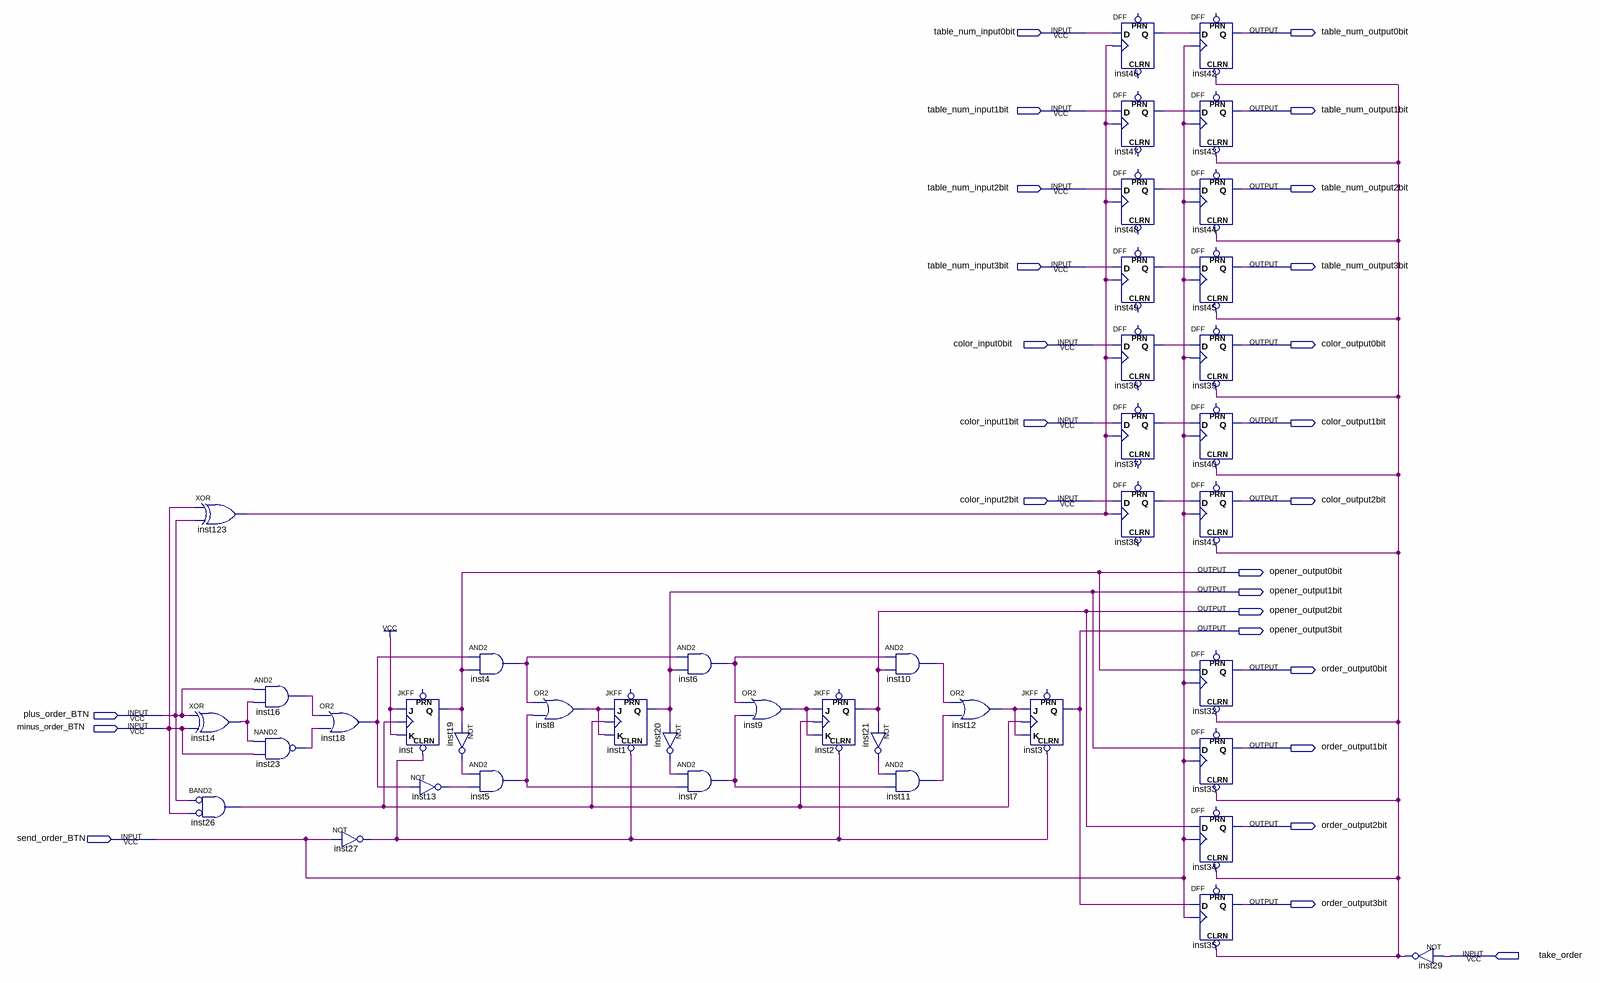
[diagram p0: schematic sheet]
// Quartus schematic opener_remote_control.bdf as structural Verilog: 43 symbols, 26 pins
module opener_remote_control (
  input  table_num_input0bit,
  input  table_num_input1bit,
  input  table_num_input2bit,
  input  table_num_input3bit,
  input  color_input0bit,
  input  color_input1bit,
  input  color_input2bit,
  input  plus_order_BTN,
  input  minus_order_BTN,
  input  send_order_BTN,
  input  take_order,
  output table_num_output0bit,
  output table_num_output1bit,
  output table_num_output2bit,
  output table_num_output3bit,
  output color_output0bit,
  output color_output1bit,
  output color_output2bit,
  output opener_output0bit,
  output opener_output1bit,
  output opener_output2bit,
  output opener_output3bit,
  output order_output0bit,
  output order_output1bit,
  output order_output2bit,
  output order_output3bit
);

  wire inst4_out, inst5_out, inst6_out, inst7_out, inst8_out, inst9_out, inst10_out, inst11_out, inst12_out,
       inst13_out, inst14_out, inst16_out, inst18_out, inst19_out, inst20_out, inst21_out, inst23_out,
       inst26_out, inst27_out, inst29_out, inst36_q, inst37_q, inst38_q, inst46_q, inst47_q, inst48_q,
       inst49_q, inst123_out;

  xor inst123 (inst123_out, minus_order_BTN, plus_order_BTN);
  xor inst14 (inst14_out, plus_order_BTN, minus_order_BTN);
  and inst26 (inst26_out, ~plus_order_BTN, ~minus_order_BTN);  // BAND2
  and inst16 (inst16_out, plus_order_BTN, inst14_out);
  nand inst23 (inst23_out, inst14_out, minus_order_BTN);
  or inst18 (inst18_out, inst16_out, inst23_out);
  not inst27 (inst27_out, send_order_BTN);
  JKFF inst (.CLRN(inst27_out), .K(1'b1), .J(1'b1), .CLK(inst26_out), .Q(opener_output0bit));  // open: PRN
  not inst13 (inst13_out, inst18_out);
  not inst19 (inst19_out, opener_output0bit);
  and inst4 (inst4_out, inst18_out, opener_output0bit);
  and inst5 (inst5_out, inst19_out, inst13_out);
  or inst8 (inst8_out, inst4_out, inst5_out);
  JKFF inst1 (.CLRN(inst27_out), .K(inst8_out), .J(inst8_out), .CLK(inst26_out), .Q(opener_output1bit));  // open: PRN
  not inst20 (inst20_out, opener_output1bit);
  and inst6 (inst6_out, inst4_out, opener_output1bit);
  and inst7 (inst7_out, inst20_out, inst5_out);
  or inst9 (inst9_out, inst6_out, inst7_out);
  JKFF inst2 (.CLRN(inst27_out), .K(inst9_out), .J(inst9_out), .CLK(inst26_out), .Q(opener_output2bit));  // open: PRN
  not inst21 (inst21_out, opener_output2bit);
  and inst10 (inst10_out, inst6_out, opener_output2bit);
  and inst11 (inst11_out, inst21_out, inst7_out);
  or inst12 (inst12_out, inst10_out, inst11_out);
  JKFF inst3 (.CLRN(inst27_out), .K(inst12_out), .J(inst12_out), .CLK(inst26_out), .Q(opener_output3bit));  // open: PRN
  DFF inst46 (.CLK(inst123_out), .D(table_num_input0bit), .Q(inst46_q));  // open: CLRN, PRN
  DFF inst47 (.CLK(inst123_out), .D(table_num_input1bit), .Q(inst47_q));  // open: CLRN, PRN
  DFF inst48 (.CLK(inst123_out), .D(table_num_input2bit), .Q(inst48_q));  // open: CLRN, PRN
  DFF inst49 (.CLK(inst123_out), .D(table_num_input3bit), .Q(inst49_q));  // open: CLRN, PRN
  DFF inst36 (.CLK(inst123_out), .D(color_input0bit), .Q(inst36_q));  // open: CLRN, PRN
  DFF inst37 (.CLK(inst123_out), .D(color_input1bit), .Q(inst37_q));  // open: CLRN, PRN
  DFF inst38 (.CLK(inst123_out), .D(color_input2bit), .Q(inst38_q));  // open: CLRN, PRN
  DFF inst42 (.CLRN(inst29_out), .CLK(send_order_BTN), .D(inst46_q), .Q(table_num_output0bit));  // open: PRN
  DFF inst43 (.CLRN(inst29_out), .CLK(send_order_BTN), .D(inst47_q), .Q(table_num_output1bit));  // open: PRN
  DFF inst44 (.CLRN(inst29_out), .CLK(send_order_BTN), .D(inst48_q), .Q(table_num_output2bit));  // open: PRN
  DFF inst45 (.CLRN(inst29_out), .CLK(send_order_BTN), .D(inst49_q), .Q(table_num_output3bit));  // open: PRN
  DFF inst39 (.CLRN(inst29_out), .CLK(send_order_BTN), .D(inst36_q), .Q(color_output0bit));  // open: PRN
  DFF inst40 (.CLRN(inst29_out), .CLK(send_order_BTN), .D(inst37_q), .Q(color_output1bit));  // open: PRN
  DFF inst41 (.CLRN(inst29_out), .CLK(send_order_BTN), .D(inst38_q), .Q(color_output2bit));  // open: PRN
  DFF inst32 (.CLRN(inst29_out), .CLK(send_order_BTN), .D(opener_output0bit), .Q(order_output0bit));  // open: PRN
  DFF inst33 (.CLRN(inst29_out), .CLK(send_order_BTN), .D(opener_output1bit), .Q(order_output1bit));  // open: PRN
  DFF inst34 (.CLRN(inst29_out), .CLK(send_order_BTN), .D(opener_output2bit), .Q(order_output2bit));  // open: PRN
  DFF inst35 (.CLRN(inst29_out), .CLK(send_order_BTN), .D(opener_output3bit), .Q(order_output3bit));  // open: PRN
  not inst29 (inst29_out, take_order);
endmodule
